# EAGLE design angel (EAGLE 9.5.2)
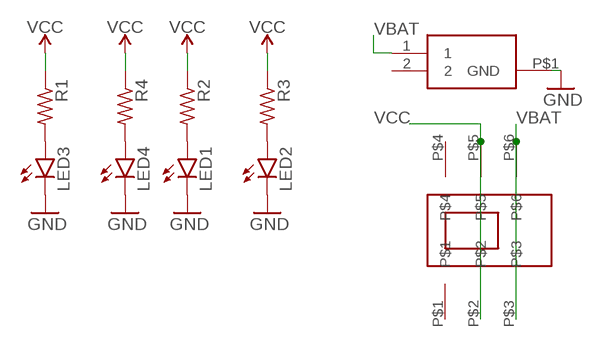
[diagram p0: schematic, sheet 1]

## Parts
LED1  LEDCHIP-LED0805  [CHIP-LED0805]
LED2  LEDCHIP-LED0805  [CHIP-LED0805]
LED3  LEDCHIP-LED0805  [CHIP-LED0805]
LED4  LEDCHIP-LED0805  [CHIP-LED0805]
R1  R-US_R0603  [R0603]
R2  R-US_R0603  [R0603]
R3  R-US_R0603  [R0603]
R4  R-US_R0603  [R0603]
U$1  CL-SB-22A-02T-SLIDE-SWITCH-TUCKED-PADS  [CL-SB-22A-02T-DPDT-COMPACT-SWITCH]
VBAT  BAT-HLD-012-SMT  [BATHLD012SMT]

## Nets
GND: LED1.C LED2.C LED3.C LED4.C VBAT.P$1(GND)
N$1: LED1.A R2.2
N$2: LED2.A R3.2
N$3: LED3.A R1.2
N$4: LED4.A R4.2
VBAT: U$1.P$3 U$1.P$6 VBAT.1
VCC: R1.1 R2.1 R3.1 R4.1 U$1.P$2 U$1.P$5
Unconnected: U$1.P$1 U$1.P$4 VBAT.2

## Library data of the parts
LED1-LED4 = led:LED: LED OSRAM: - CHIPLED LG R971, LG N971, LY N971, LG Q971, LY Q971, LO R971, LY R971 LH N974, LH R974 LS Q976, LO Q976, LY Q976 LO Q996 - Hyper CHIPLED LW Q18S LB Q993, LB Q99A, LB R99A - SideLED LS A670, LO A670, LY A670, LG A670, LP A670 LB A673, LV A673, LT A673, LW A673 LH A674 LY A675 LS A676, LA A676, LO A676, LY A676, LW A676 LS A679, LY A679, LG A679 - Hyper Micro SIDELED® LS Y876, LA Y876, LO Y876, LY Y876 LT Y87S - SmartLED LW L88C, LW L88S LB L89C, LB L89S, LG L890 LS L89K, LO L89K, LY L89K LS L896, LA L896, LO L896, LY L896 - TOPLED LS T670, LO T670, LY T670, LG T670, LP T670 LSG T670, LSP T670, LSY T670, LOP T670, LYG T670 LG T671, LOG T671, LSG T671 LB T673, LV T673, LT T673, LW T673 LH T674 LS T676, LA T676, LO T676, LY T676, LB T676, LH T676, LSB T676, LW T676 LB T67C, LV T67C, LT T67C, LS T67K, LO T67K, LY T67K, LW E67C LS E67B, LA E67B, LO E67B, LY E67B, LB E67C, LV E67C, LT E67C LW T67C LS T679, LY T679, LG T679 LS T770, LO T770, LY T770, LG T770, LP T770 LB T773, LV T773, LT T773, LW T773 LH T774 LS E675, LA E675, LY E675, LS T675 LS T776, LA T776, LO T776, LY T776, LB T776 LHGB T686 LT T68C, LB T68C - Hyper Mini TOPLED® LB M676 - Mini TOPLED Santana® LG M470 LS M47K, LO M47K, LY M47K Source: http://www.osram.convergy.de LUXEON: - LUMILED® LXK2-PW12-R00, LXK2-PW12-S00, LXK2-PW14-U00, LXK2-PW14-V00 LXK2-PM12-R00, LXK2-PM12-S00, LXK2-PM14-U00 LXK2-PE12-Q00, LXK2-PE12-R00, LXK2-PE12-S00, LXK2-PE14-T00, LXK2-PE14-U00 LXK2-PB12-K00, LXK2-PB12-L00, LXK2-PB12-M00, LXK2-PB14-N00, LXK2-PB14-P00, LXK2-PB14-Q00 LXK2-PR12-L00, LXK2-PR12-M00, LXK2-PR14-Q00, LXK2-PR14-R00 LXK2-PD12-Q00, LXK2-PD12-R00, LXK2-PD12-S00 LXK2-PH12-R00, LXK2-PH12-S00 LXK2-PL12-P00, LXK2-PL12-Q00, LXK2-PL12-R00 Source: www.luxeon.com KINGBRIGHT: KA-3528ASYC Source: www.kingbright.com
R1-R4 = rcl:R-US_: RESISTOR, American symbol; SPICEPREFIX: R
U$1 = electroninks:CL-SB-22A-02T-SLIDE-SWITCH-TUCKED-PADS
VBAT = SamacSys_Parts:BAT-HLD-012-SMT: Coin Cell Battery Holders Bat Hld CR1216/1225 Surface Mount Source: Datasheet <https://componentsearchengine.com/Datasheets/1/BAT-HLD-012-SMT.pdf>; DESCRIPTION: Coin Cell Battery Holders Bat Hld CR1216/1225 Surface Mount; HEIGHT: 3mm; MANUFACTURER_NAME: Linx Technologies; MANUFACTURER_PART_NUMBER: BAT-HLD-012-SMT; MOUSER_PART_NUMBER: 712-BAT-HLD-012-SMT; MOUSER_PRICE-STOCK: https://www.mouser.com/Search/Refine.aspx?Keyword=712-BAT-HLD-012-SMT

## Board
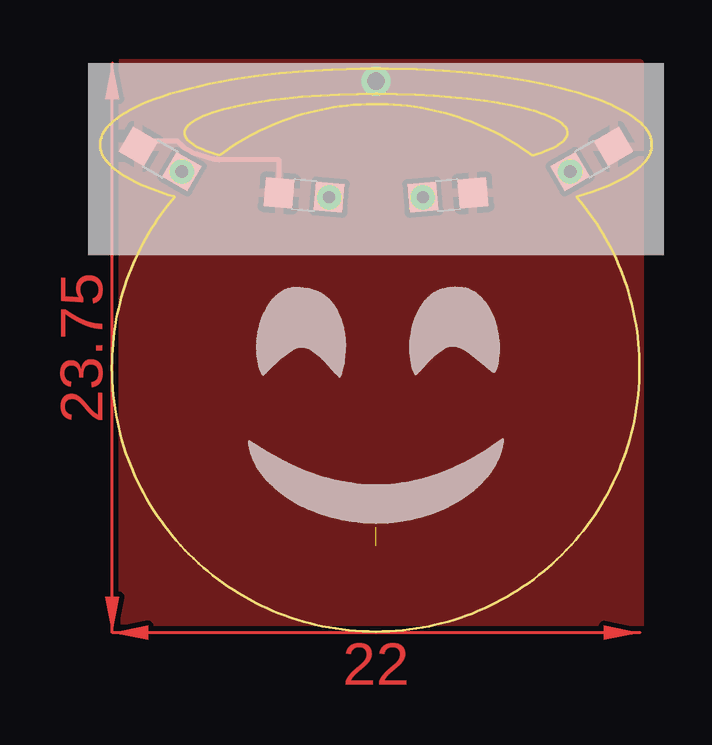
[diagram p1: board, top side]
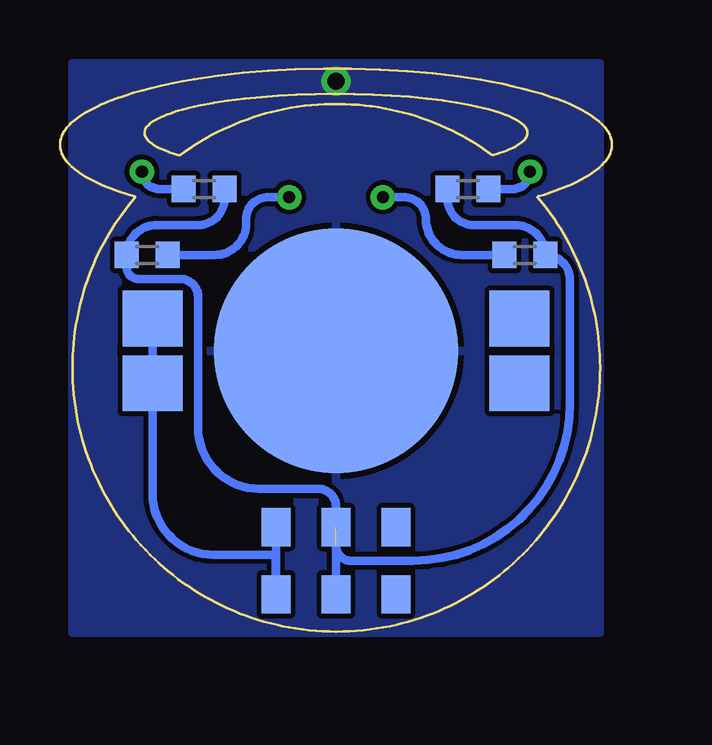
[diagram p2: board, bottom side, seen from below]

Size 23.02 x 23.48 mm. Coordinates in mm from the lower left corner, seen from the top.
Outline: 23.02,20.3 23.02,20.37 23.01,20.44 22.99,20.51 22.98,20.58 22.95,20.65 22.92,20.71 22.89,20.78 22.86,20.84 22.82,20.9 22.78,20.95 22.73,21.01 22.64,21.11 22.54,21.21 22.49,21.26 22.43,21.31 22.32,21.39 22.21,21.48 22.15,21.52 22.09,21.56 21.97,21.63 21.85,21.7 21.73,21.77 21.6,21.83 21.47,21.89 21.28,21.98 21.15,22.04 21.02,22.09 20.69,22.22 20.36,22.33 20.29,22.36 19.96,22.46 19.62,22.56 19.21,22.66 18.79,22.76 18.31,22.87 17.9,22.95 17.41,23.03 16.43,23.17 15.38,23.3 14.33,23.38 13.2,23.45 12,23.48 10.87,23.47 9.68,23.44 8.55,23.37 7.49,23.28 6.44,23.16 5.47,23.01 5.05,22.93 4.57,22.84 4.09,22.73 3.74,22.65 3.33,22.54 2.93,22.42 2.59,22.31 2.26,22.19 1.93,22.07 1.74,21.98 1.61,21.92 1.48,21.86 1.35,21.8 1.23,21.73 1.11,21.66 0.99,21.59 0.87,21.52 0.81,21.48 0.75,21.44 0.64,21.35 0.53,21.26 0.43,21.16 0.38,21.11 0.33,21.06 0.28,21.01 0.24,20.95 0.2,20.9 0.16,20.84 0.13,20.78 0.09,20.71 0.07,20.65 0.04,20.58 0.02,20.51 0.01,20.44 0,20.37 0,20.3 0,20.23 0.01,20.16 0.03,20.09 0.04,20.03 0.07,19.96 0.1,19.89 0.13,19.83 0.16,19.77 0.2,19.71 0.24,19.65 0.29,19.6 0.33,19.55 0.38,19.49 0.43,19.44 0.53,19.35 0.64,19.26 0.75,19.17 0.87,19.09 0.93,19.05 0.99,19.02 1.11,18.94 1.3,18.84 1.48,18.75 1.61,18.68 1.74,18.63 1.87,18.57 2.13,18.47 2.2,18.44 2.53,18.32 2.86,18.21 3.07,18.15 3.12,18.12 2.98,17.96 2.81,17.74 2.68,17.57 2.55,17.4 2.39,17.17 2.28,16.99 2.16,16.82 2.02,16.57 1.91,16.39 1.81,16.21 1.68,15.96 1.58,15.77 1.46,15.51 1.38,15.32 1.3,15.12 1.19,14.86 1.12,14.66 1.03,14.39 0.97,14.19 0.89,13.92 0.84,13.72 0.77,13.44 0.73,13.23 0.68,13.03 0.64,12.75 0.6,12.47 0.57,12.26 0.54,11.98 0.52,11.77 0.51,11.49 0.5,11.27 0.5,10.99 0.5,10.71 0.51,10.43 0.53,10.22 0.53,10.15 0.56,9.87 0.59,9.59 0.63,9.31 0.67,9.03 0.73,8.75 0.77,8.54 0.84,8.27 0.91,8 0.93,7.93 0.99,7.73 1.08,7.46 1.17,7.19 1.25,7 1.36,6.73 1.38,6.67 1.47,6.48 1.59,6.22 1.71,5.97 1.81,5.78 1.95,5.53 2.09,5.29 2.24,5.05 2.36,4.87 2.52,4.64 2.56,4.59 2.69,4.41 2.86,4.19 2.99,4.03 3.17,3.81 3.36,3.6 3.55,3.39 3.7,3.24 3.9,3.04 4.11,2.85 4.32,2.67 4.48,2.53 4.7,2.35 4.92,2.18 5.15,2.01 5.33,1.89 5.56,1.74 5.8,1.59 6.04,1.45 6.23,1.34 6.48,1.21 6.73,1.08 6.99,0.96 7.25,0.85 7.44,0.77 7.7,0.67 7.97,0.58 8.24,0.49 8.51,0.41 8.78,0.34 8.99,0.29 9.26,0.23 9.54,0.17 9.82,0.13 10.1,0.09 10.38,0.06 10.66,0.03 10.94,0.01 11.22,0 11.5,0 11.79,0 12.07,0.01 12.35,0.03 12.63,0.06 12.91,0.09 13.19,0.13 13.47,0.18 13.75,0.23 13.95,0.28 14.23,0.34 14.5,0.41 14.77,0.5 15.04,0.58 15.3,0.68 15.5,0.75 15.76,0.86 16.02,0.97 16.28,1.09 16.53,1.22 16.72,1.31 16.96,1.45 17.21,1.6 17.45,1.75 17.62,1.86 17.85,2.02 18.08,2.19 18.31,2.36 18.53,2.54 18.69,2.67 18.85,2.81 18.9,2.86 19.05,3.01 19.26,3.2 19.45,3.4 19.65,3.61 19.83,3.82 19.97,3.98 20.15,4.2 20.32,4.43 20.48,4.65 20.6,4.83 20.76,5.06 20.91,5.3 21.05,5.55 21.16,5.73 21.29,5.98 21.41,6.23 21.53,6.49 21.64,6.75 21.72,6.94 21.83,7.21 21.92,7.47 22.01,7.74 22.09,8.01 22.16,8.28 22.21,8.49 22.27,8.76 22.32,9.04 22.37,9.32 22.41,9.6 22.44,9.88 22.47,10.16 22.48,10.44 22.49,10.72 22.5,11.01 22.49,11.29 22.49,11.5 22.47,11.78 22.45,11.99 22.42,12.27 22.4,12.48 22.36,12.76 22.31,13.04 22.27,13.25 22.22,13.45 22.17,13.66 22.1,13.93 22.02,14.2 21.96,14.41 21.89,14.61 21.82,14.81 21.72,15.07 21.64,15.26 21.53,15.52 21.44,15.72 21.31,15.97 21.18,16.22 21.08,16.4 20.97,16.59 20.86,16.77 20.71,17.01 20.59,17.18 20.47,17.36 20.31,17.58 20.13,17.81 20.05,17.92 19.91,18.08 19.89,18.13 20.22,18.23 20.56,18.34 20.89,18.47 21.22,18.6 21.34,18.66 21.47,18.72 21.6,18.78 21.73,18.84 21.85,18.91 21.97,18.98 22.09,19.05 22.21,19.13 22.27,19.17 22.38,19.26 22.43,19.3 22.54,19.4 22.64,19.49 22.69,19.55 22.73,19.6 22.78,19.66 22.82,19.71 22.86,19.77 22.89,19.83 22.92,19.9 22.95,19.96 22.98,20.03 22.99,20.09 23.01,20.16 23.02,20.23 23.02,20.3
Outline: 10.76,22.41 11.52,22.42 12.37,22.41 13.14,22.39 13.92,22.35 14.62,22.29 15.33,22.22 16.03,22.14 16.58,22.05 16.65,22.04 17.14,21.95 17.41,21.89 17.69,21.82 17.89,21.77 18.1,21.71 18.17,21.69 18.37,21.63 18.57,21.55 18.7,21.5 18.76,21.47 18.89,21.41 18.95,21.38 19.01,21.35 19.13,21.28 19.19,21.24 19.25,21.19 19.3,21.15 19.35,21.1 19.4,21.04 19.44,20.99 19.47,20.92 19.49,20.86 19.49,20.79 19.48,20.72 19.46,20.65 19.43,20.59 19.39,20.53 19.34,20.48 19.29,20.43 19.24,20.39 19.18,20.34 19.12,20.3 19.06,20.27 19,20.23 18.88,20.17 18.75,20.11 18.62,20.05 18.55,20.03 18.42,19.98 18.22,19.91 18.08,19.87 18.02,19.86 17.79,20.02 17.61,20.14 17.38,20.3 17.2,20.41 17.14,20.45 16.89,20.59 16.71,20.69 16.46,20.82 16.2,20.94 15.95,21.06 15.75,21.15 15.49,21.25 15.23,21.35 15.16,21.37 14.96,21.44 14.69,21.53 14.42,21.61 14.22,21.66 13.94,21.73 13.66,21.79 13.39,21.84 13.11,21.88 12.83,21.92 12.55,21.95 12.27,21.97 11.99,21.99 11.77,22 11.7,22 11.42,22 11.14,21.99 10.86,21.98 10.57,21.96 10.29,21.93 10.08,21.91 10.01,21.9 9.73,21.86 9.46,21.81 9.25,21.77 8.97,21.71 8.7,21.64 8.43,21.57 8.16,21.48 7.96,21.42 7.62,21.3 7.43,21.22 7.17,21.11 6.91,21 6.65,20.88 6.46,20.78 6.21,20.65 6.15,20.62 5.97,20.51 5.73,20.37 5.49,20.21 5.31,20.1 5.02,19.89 4.96,19.86 4.76,19.92 4.71,19.94 4.58,19.99 4.51,20.01 4.38,20.06 4.31,20.09 4.25,20.12 4.12,20.18 4.06,20.21 3.94,20.28 3.88,20.32 3.82,20.36 3.76,20.4 3.71,20.45 3.66,20.5 3.62,20.55 3.58,20.61 3.55,20.67 3.53,20.74 3.53,20.81 3.54,20.88 3.56,20.94 3.6,21.01 3.64,21.06 3.68,21.11 3.73,21.16 3.79,21.21 3.85,21.25 3.9,21.29 3.96,21.33 4.09,21.39 4.21,21.45 4.28,21.48 4.41,21.54 4.48,21.56 4.67,21.63 4.88,21.7 5.15,21.78 5.35,21.83 5.63,21.89 5.9,21.95 6.46,22.05 7.02,22.14 7.09,22.15 7.72,22.23 8.42,22.29 9.19,22.35 9.97,22.39 10.73,22.41 10.76,22.41
Copper layers (1*16): Top 0.035mm / dielectric 1.5mm / Bottom 0.035mm
Design rules "SparkFun *": minimum track width 8mil, minimum drill 20mil, track to track 8mil, track to pad 8mil, pad to pad 8mil, via to via 8mil, smd to smd 8mil, copper to edge 0mil, drill to drill 8mil, minimum pad ring 12mil, minimum via ring 10mil, stop-mask expansion 4mil, vias tented up to drill 1.7mm, thermal gap 10mil

### Footprints (pad centres in the part's own frame; a part is rotated, then mirrored left to right if it is on the bottom)
CHIP-LED0805 = smd 1.2 x 1.2: A 0,-1.05; C 0,1.05
R0603 = smd 1 x 1.1: 1 -0.85,0; 2 0.85,0
CL-SB-22A-02T-DPDT-COMPACT-SWITCH = smd 1.2 x 1.6: P$1 -2.5,-1.4; P$2 0,-1.4; P$3 2.5,-1.4; P$4 -2.5,1.4; P$5 0,1.4; P$6 2.5,1.4
BATHLD012SMT = smd 2.5 x 2.325: 1 -7.65,1.35; 2 7.65,1.35; P$2 -7.65,-1.35; P$3 7.65,-1.35 | smd 10.2 x 10.2: P$1 0,0

### Placement (x,y rotation side)
LED1  2.51,19.71 60 top
LED2  20.51,19.71 300 top
LED3  8.51,18.21 85 top
LED4  14.51,18.21 275 top
R1  3.63,15.71 180 bottom
R2  6.01,18.46 0 bottom
R3  17.01,18.46 180 bottom
R4  19.38,15.71 0 bottom
U$1  11.51,2.96 180 bottom
VBAT  11.51,11.71 0 bottom

### Tracks (layer width: path | path; a pad name or v marks a point on that pad's centre or on a via)
GND  (via drill 0.7 pad 0.85)
  Top 0.203: LED1.C 1.6,20.46 | 1.6,20.46 1.6,20.71 | 4.98,19.67 4.91,19.69 4.87,19.71 4.76,19.71 3.82,19.99 3.51,20.17 3.23,20.46 1.6,20.46 | LED3.C 7.46,19.67 4.98,19.67 | 4.98,19.67
  other vias: 11.51,22.96
  pour Bottom (rank 3): 0.51,-0.04 0.51,23.71 22.51,23.71 22.51,-0.04
  pour Top (rank 3): 0.51,-0.04 0.51,23.71 22.51,23.71 22.51,-0.04
N$1  (via drill 0.51)
  Bottom 0.35: LED1.A arc90 4.14,18.46 R2.2
  other vias: 3.42,19.18
N$2  (via drill 0.51)
  Bottom 0.35: LED2.A arc-90 18.88,18.46 R3.2
  other vias: 19.6,19.18
N$3  (via drill 0.51)
  Bottom 0.35: R1.2 6.26,15.71 arc90 7.76,17.21 arc-90 8.67,18.11 LED3.A
  other vias: 9.56,18.11
N$4  (via drill 0.51)
  Bottom 0.35: R4.2 16.56,15.71 arc-90 15.26,17 15.26,17.21 arc90 14.35,18.11 LED4.A
  other vias: 13.46,18.11
VBAT
  Bottom 0.35: 14.03,3.03 14.03,1.58 U$1.P$6 14.01,3.21 | 14.01,3.21 U$1.P$3 | 19.49,13.06 VBAT.1 19.16,5.75 arc-90 16.62,3.21 14.01,3.21
VCC  (1 unrouted)
  Bottom 0.35: 16.01,18.46 R3.1 16.16,18.06 arc90 17.26,16.96 18.98,16.96 arc-90 R4.1 20.23,15.18 arc-90 19.76,14.71 18.01,14.71 arc90 17.26,13.96 17.26,8.5 arc-90 14.72,5.96 12.26,5.96 arc90 11.51,5.21 U$1.P$2 | 11.51,3.58 arc-90 10.88,2.96 8.3,2.96 arc-90 1.76,9.5 1.76,14.68 arc-90 R1.1 arc-90 4.03,16.96 5.76,16.96 arc90 6.86,18.06 R2.1 | U$1.P$2 11.51,4.71 | U$1.P$5 U$1.P$2
(copper drawn outside any net)
  shapes: Top area x2